# EAGLE schematic ah (EAGLE 6.5.0)
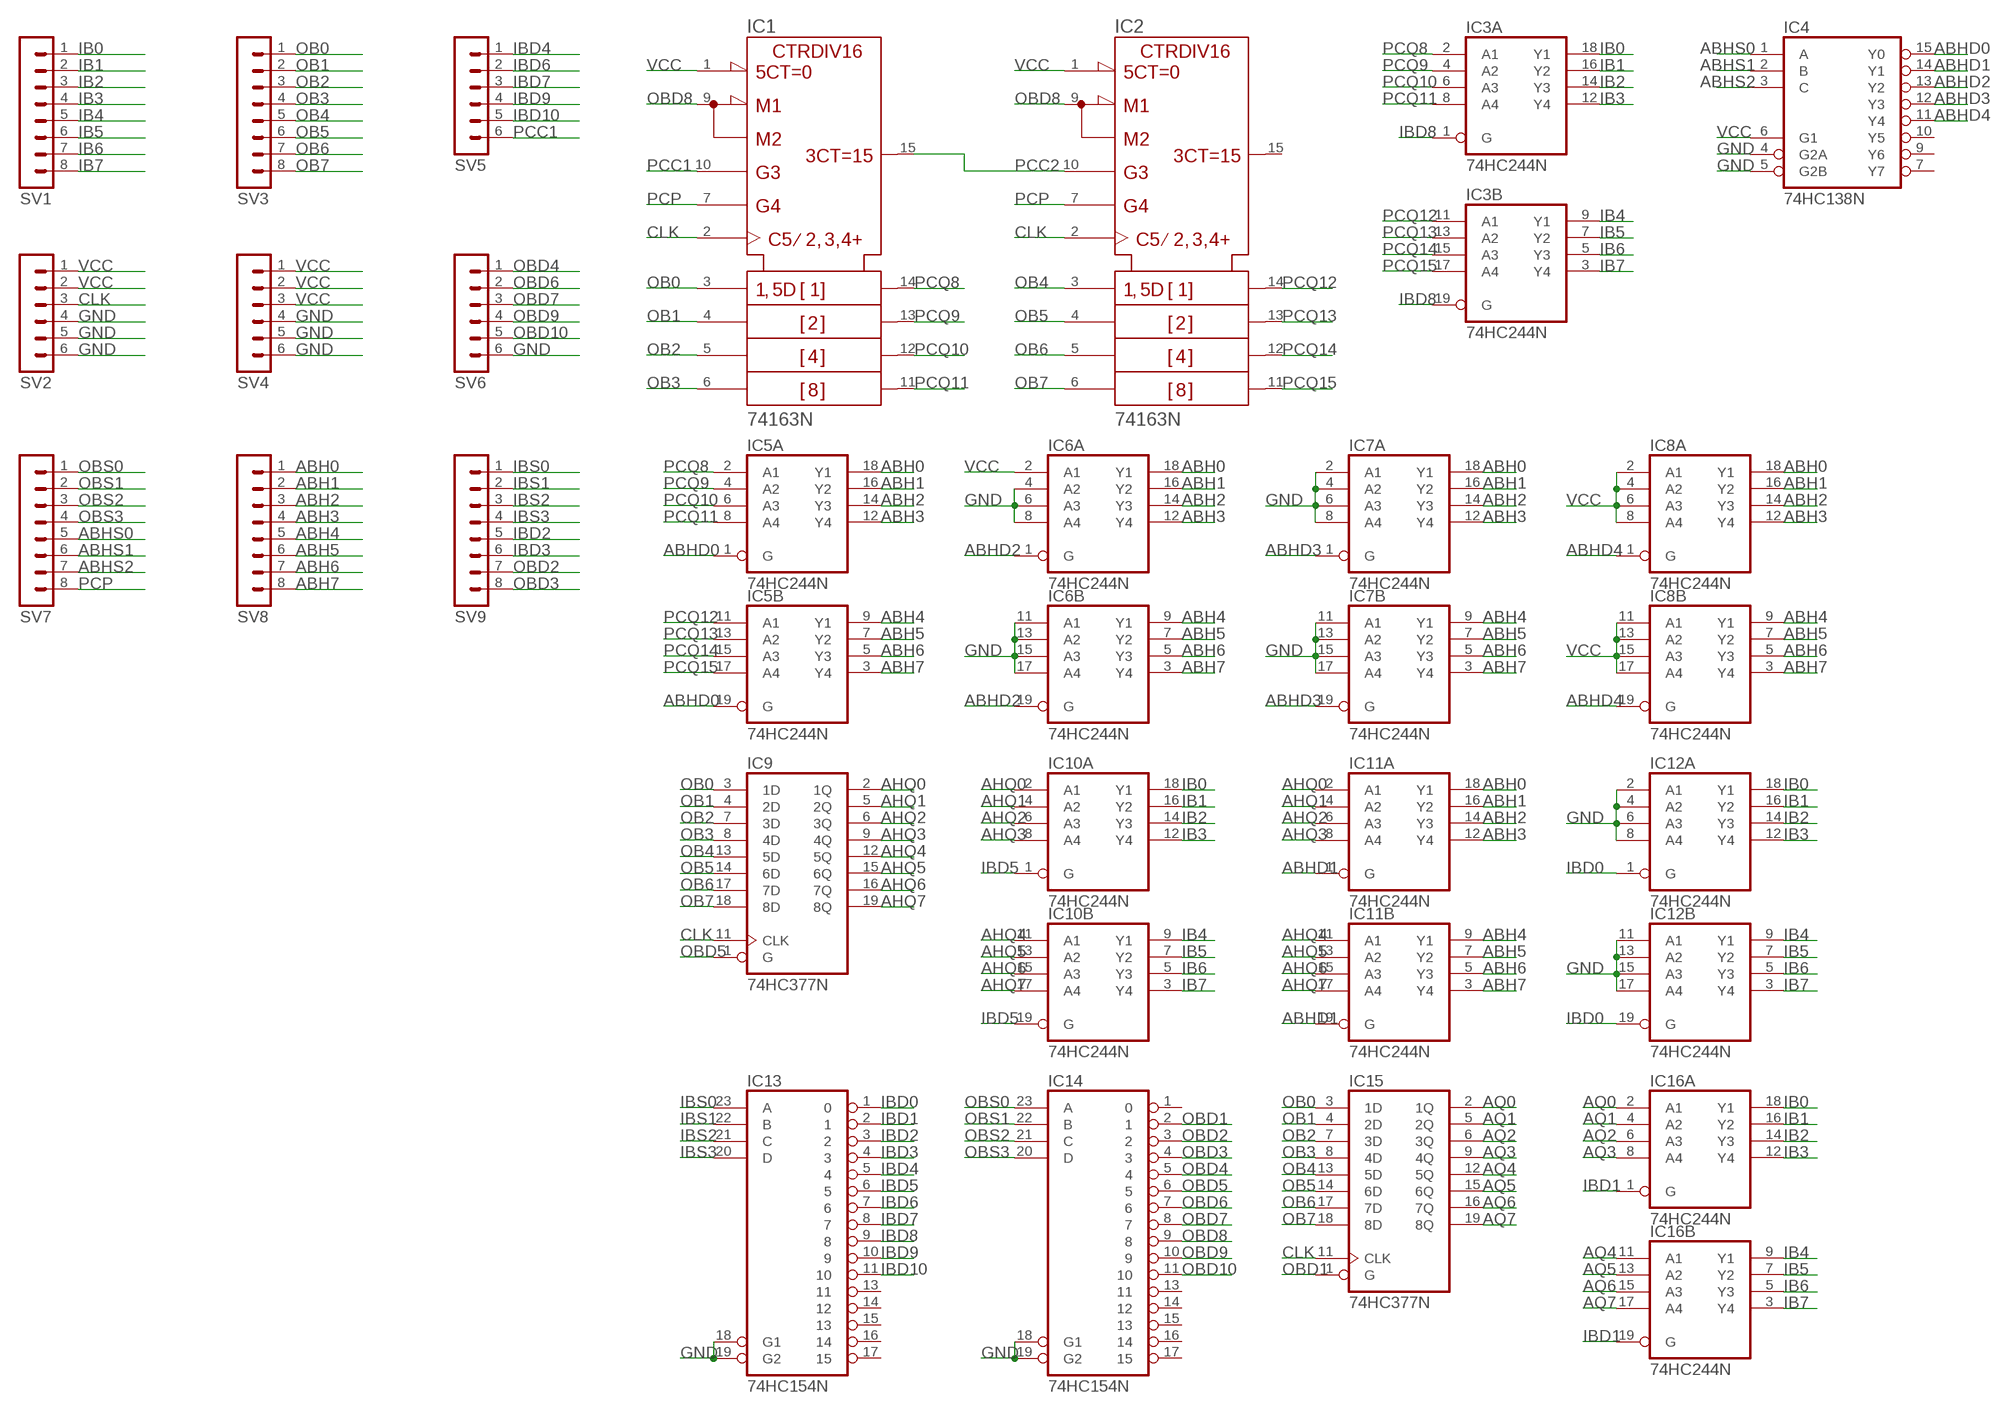
[diagram p0: schematic, sheet 1]

## Parts
IC1  74163N  [DIL16]
IC2  74163N  [DIL16]
IC3  74HC244N  [DIL20]
IC4  74HC138N  [DIL16]
IC5  74HC244N  [DIL20]
IC6  74HC244N  [DIL20]
IC7  74HC244N  [DIL20]
IC8  74HC244N  [DIL20]
IC9  74HC377N  [DIL20]
IC10  74HC244N  [DIL20]
IC11  74HC244N  [DIL20]
IC12  74HC244N  [DIL20]
IC13  74HC154N  [DIL24-6]
IC14  74HC154N  [DIL24-6]
IC15  74HC377N  [DIL20]
IC16  74HC244N  [DIL20]
SV1  MA08-1  [MA08-1]
SV2  MA06-1  [MA06-1]
SV3  MA08-1  [MA08-1]
SV4  MA06-1  [MA06-1]
SV5  MA06-1  [MA06-1]
SV6  MA06-1  [MA06-1]
SV7  MA08-1  [MA08-1]
SV8  MA08-1  [MA08-1]
SV9  MA08-1  [MA08-1]

## Nets
ABH0: IC5.18(A:Y1) IC6.18(A:Y1) IC7.18(A:Y1) IC8.18(A:Y1) IC11.18(A:Y1) SV8.1
ABH1: IC5.16(A:Y2) IC6.16(A:Y2) IC7.16(A:Y2) IC8.16(A:Y2) IC11.16(A:Y2) SV8.2
ABH2: IC5.14(A:Y3) IC6.14(A:Y3) IC7.14(A:Y3) IC8.14(A:Y3) IC11.14(A:Y3) SV8.3
ABH3: IC5.12(A:Y4) IC6.12(A:Y4) IC7.12(A:Y4) IC8.12(A:Y4) IC11.12(A:Y4) SV8.4
ABH4: IC5.9(B:Y1) IC6.9(B:Y1) IC7.9(B:Y1) IC8.9(B:Y1) IC11.9(B:Y1) SV8.5
ABH5: IC5.7(B:Y2) IC6.7(B:Y2) IC7.7(B:Y2) IC8.7(B:Y2) IC11.7(B:Y2) SV8.6
ABH6: IC5.5(B:Y3) IC6.5(B:Y3) IC7.5(B:Y3) IC8.5(B:Y3) IC11.5(B:Y3) SV8.7
ABH7: IC5.3(B:Y4) IC6.3(B:Y4) IC7.3(B:Y4) IC8.3(B:Y4) IC11.3(B:Y4) SV8.8
ABHD0: IC4.15(Y0) IC5.1(A:G) IC5.19(B:G)
ABHD1: IC4.14(Y1) IC11.1(A:G) IC11.19(B:G)
ABHD2: IC4.13(Y2) IC6.1(A:G) IC6.19(B:G)
ABHD3: IC4.12(Y3) IC7.1(A:G) IC7.19(B:G)
ABHD4: IC4.11(Y4) IC8.1(A:G) IC8.19(B:G)
ABHS0: IC4.1(A) SV7.5
ABHS1: IC4.2(B) SV7.6
ABHS2: IC4.3(C) SV7.7
AHQ0: IC9.2(1Q) IC10.2(A:A1) IC11.2(A:A1)
AHQ1: IC9.5(2Q) IC10.4(A:A2) IC11.4(A:A2)
AHQ2: IC9.6(3Q) IC10.6(A:A3) IC11.6(A:A3)
AHQ3: IC9.9(4Q) IC10.8(A:A4) IC11.8(A:A4)
AHQ4: IC9.12(5Q) IC10.11(B:A1) IC11.11(B:A1)
AHQ5: IC9.15(6Q) IC10.13(B:A2) IC11.13(B:A2)
AHQ6: IC9.16(7Q) IC10.15(B:A3) IC11.15(B:A3)
AHQ7: IC9.19(8Q) IC10.17(B:A4) IC11.17(B:A4)
AQ0: IC15.2(1Q) IC16.2(A:A1)
AQ1: IC15.5(2Q) IC16.4(A:A2)
AQ2: IC15.6(3Q) IC16.6(A:A3)
AQ3: IC15.9(4Q) IC16.8(A:A4)
AQ4: IC15.12(5Q) IC16.11(B:A1)
AQ5: IC15.15(6Q) IC16.13(B:A2)
AQ6: IC15.16(7Q) IC16.15(B:A3)
AQ7: IC15.19(8Q) IC16.17(B:A4)
CLK: IC1.2(CLK) IC2.2(CLK) IC9.11(CLK) IC15.11(CLK) SV2.3
GND: IC4.4(G2A) IC4.5(G2B) IC6.4(A:A2) IC6.6(A:A3) IC6.8(A:A4) IC6.11(B:A1) IC6.13(B:A2) IC6.15(B:A3) IC6.17(B:A4) IC7.2(A:A1) IC7.4(A:A2) IC7.6(A:A3) IC7.8(A:A4) IC7.11(B:A1) IC7.13(B:A2) IC7.15(B:A3) IC7.17(B:A4) IC12.2(A:A1) IC12.4(A:A2) IC12.6(A:A3) IC12.8(A:A4) IC12.11(B:A1) IC12.13(B:A2) IC12.15(B:A3) IC12.17(B:A4) IC13.18(G1) IC13.19(G2) IC14.18(G1) IC14.19(G2) SV2.4 SV2.5 SV2.6 SV4.4 SV4.5 SV4.6 SV6.6
IB0: IC3.18(A:Y1) IC10.18(A:Y1) IC12.18(A:Y1) IC16.18(A:Y1) SV1.1
IB1: IC3.16(A:Y2) IC10.16(A:Y2) IC12.16(A:Y2) IC16.16(A:Y2) SV1.2
IB2: IC3.14(A:Y3) IC10.14(A:Y3) IC12.14(A:Y3) IC16.14(A:Y3) SV1.3
IB3: IC3.12(A:Y4) IC10.12(A:Y4) IC12.12(A:Y4) IC16.12(A:Y4) SV1.4
IB4: IC3.9(B:Y1) IC10.9(B:Y1) IC12.9(B:Y1) IC16.9(B:Y1) SV1.5
IB5: IC3.7(B:Y2) IC10.7(B:Y2) IC12.7(B:Y2) IC16.7(B:Y2) SV1.6
IB6: IC3.5(B:Y3) IC10.5(B:Y3) IC12.5(B:Y3) IC16.5(B:Y3) SV1.7
IB7: IC3.3(B:Y4) IC10.3(B:Y4) IC12.3(B:Y4) IC16.3(B:Y4) SV1.8
IBD0: IC12.1(A:G) IC12.19(B:G) IC13.1
IBD1: IC13.2 IC16.1(A:G) IC16.19(B:G)
IBD2: IC13.3 SV9.5
IBD3: IC13.4 SV9.6
IBD4: IC13.5 SV5.1
IBD5: IC10.1(A:G) IC10.19(B:G) IC13.6
IBD6: IC13.7 SV5.2
IBD7: IC13.8 SV5.3
IBD8: IC3.1(A:G) IC3.19(B:G) IC13.9
IBD9: IC13.10 SV5.4
IBD10: IC13.11 SV5.5
IBS0: IC13.23(A) SV9.1
IBS1: IC13.22(B) SV9.2
IBS2: IC13.21(C) SV9.3
IBS3: IC13.20(D) SV9.4
OB0: IC1.3(A) IC9.3(1D) IC15.3(1D) SV3.1
OB1: IC1.4(B) IC9.4(2D) IC15.4(2D) SV3.2
OB2: IC1.5(C) IC9.7(3D) IC15.7(3D) SV3.3
OB3: IC1.6(D) IC9.8(4D) IC15.8(4D) SV3.4
OB4: IC2.3(A) IC9.13(5D) IC15.13(5D) SV3.5
OB5: IC2.4(B) IC9.14(6D) IC15.14(6D) SV3.6
OB6: IC2.5(C) IC9.17(7D) IC15.17(7D) SV3.7
OB7: IC2.6(D) IC9.18(8D) IC15.18(8D) SV3.8
OBD1: IC14.2 IC15.1(G)
OBD2: IC14.3 SV9.7
OBD3: IC14.4 SV9.8
OBD4: IC14.5 SV6.1
OBD5: IC9.1(G) IC14.6
OBD6: IC14.7 SV6.2
OBD7: IC14.8 SV6.3
OBD8: IC1.9(!LOAD) IC2.9(!LOAD) IC14.9
OBD9: IC14.10 SV6.4
OBD10: IC14.11 SV6.5
OBS0: IC14.23(A) SV7.1
OBS1: IC14.22(B) SV7.2
OBS2: IC14.21(C) SV7.3
OBS3: IC14.20(D) SV7.4
PCC1: IC1.10(ENT) SV5.6
PCC2: IC1.15(RCO) IC2.10(ENT)
PCP: IC1.7(ENP) IC2.7(ENP) SV7.8
PCQ8: IC1.14(QA) IC3.2(A:A1) IC5.2(A:A1)
PCQ9: IC1.13(QB) IC3.4(A:A2) IC5.4(A:A2)
PCQ10: IC1.12(QC) IC3.6(A:A3) IC5.6(A:A3)
PCQ11: IC1.11(QD) IC3.8(A:A4) IC5.8(A:A4)
PCQ12: IC2.14(QA) IC3.11(B:A1) IC5.11(B:A1)
PCQ13: IC2.13(QB) IC3.13(B:A2) IC5.13(B:A2)
PCQ14: IC2.12(QC) IC3.15(B:A3) IC5.15(B:A3)
PCQ15: IC2.11(QD) IC3.17(B:A4) IC5.17(B:A4)
VCC: IC1.1(!CLR) IC2.1(!CLR) IC4.6(G1) IC6.2(A:A1) IC8.2(A:A1) IC8.4(A:A2) IC8.6(A:A3) IC8.8(A:A4) IC8.11(B:A1) IC8.13(B:A2) IC8.15(B:A3) IC8.17(B:A4) SV2.1 SV2.2 SV4.1 SV4.2 SV4.3
Unconnected: IC2.15(RCO) IC4.7(Y7) IC4.9(Y6) IC4.10(Y5) IC13.13 IC13.14 IC13.15 IC13.16 IC13.17 IC14.1 IC14.13 IC14.14 IC14.15 IC14.16 IC14.17

## Power pins joined to a net without a drawn wire
+UB: IC1.16(+UB) IC2.16(+UB)
-UB: IC1.8(-UB) IC2.8(-UB)
GND: IC3.10(P:GND) IC4.8(GND) IC5.10(P:GND) IC6.10(P:GND) IC7.10(P:GND) IC8.10(P:GND) IC9.10(GND) IC10.10(P:GND) IC11.10(P:GND) IC12.10(P:GND) IC13.12(GND) IC14.12(GND) IC15.10(GND) IC16.10(P:GND)
VCC: IC3.20(P:VCC) IC4.16(VCC) IC5.20(P:VCC) IC6.20(P:VCC) IC7.20(P:VCC) IC8.20(P:VCC) IC9.20(VCC) IC10.20(P:VCC) IC11.20(P:VCC) IC12.20(P:VCC) IC13.24(VCC) IC14.24(VCC) IC15.20(VCC) IC16.20(P:VCC)

## Library data of the parts
IC1 IC2 = 74ttl-din:74*163: Synchrounus 4-bit COUNTER
IC3 IC5-IC8 IC10-IC12 IC16 = 74xx-eu:74*244: Octal BUFFER and LINE DRIVER, 3-state
IC4 = 74xx-eu:74*138: 3-line to 8-line DECODER/DEMULTIPLEXER
IC9 IC15 = 74xx-eu:74*377: Octal D type FLIP FLOP, enable
IC13 IC14 = 74xx-eu:74*154: 4-line to 16-line data SELECTOR/MULTIPLEXER
SV1 SV3 SV7-SV9 = con-lstb:MA08-1: PIN HEADER; OC_FARNELL: unknown; OC_NEWARK: unknown
SV2 SV4-SV6 = con-lstb:MA06-1: PIN HEADER; OC_FARNELL: unknown; OC_NEWARK: unknown